# EAGLE design 主机 v0.1 (EAGLE 6.3)
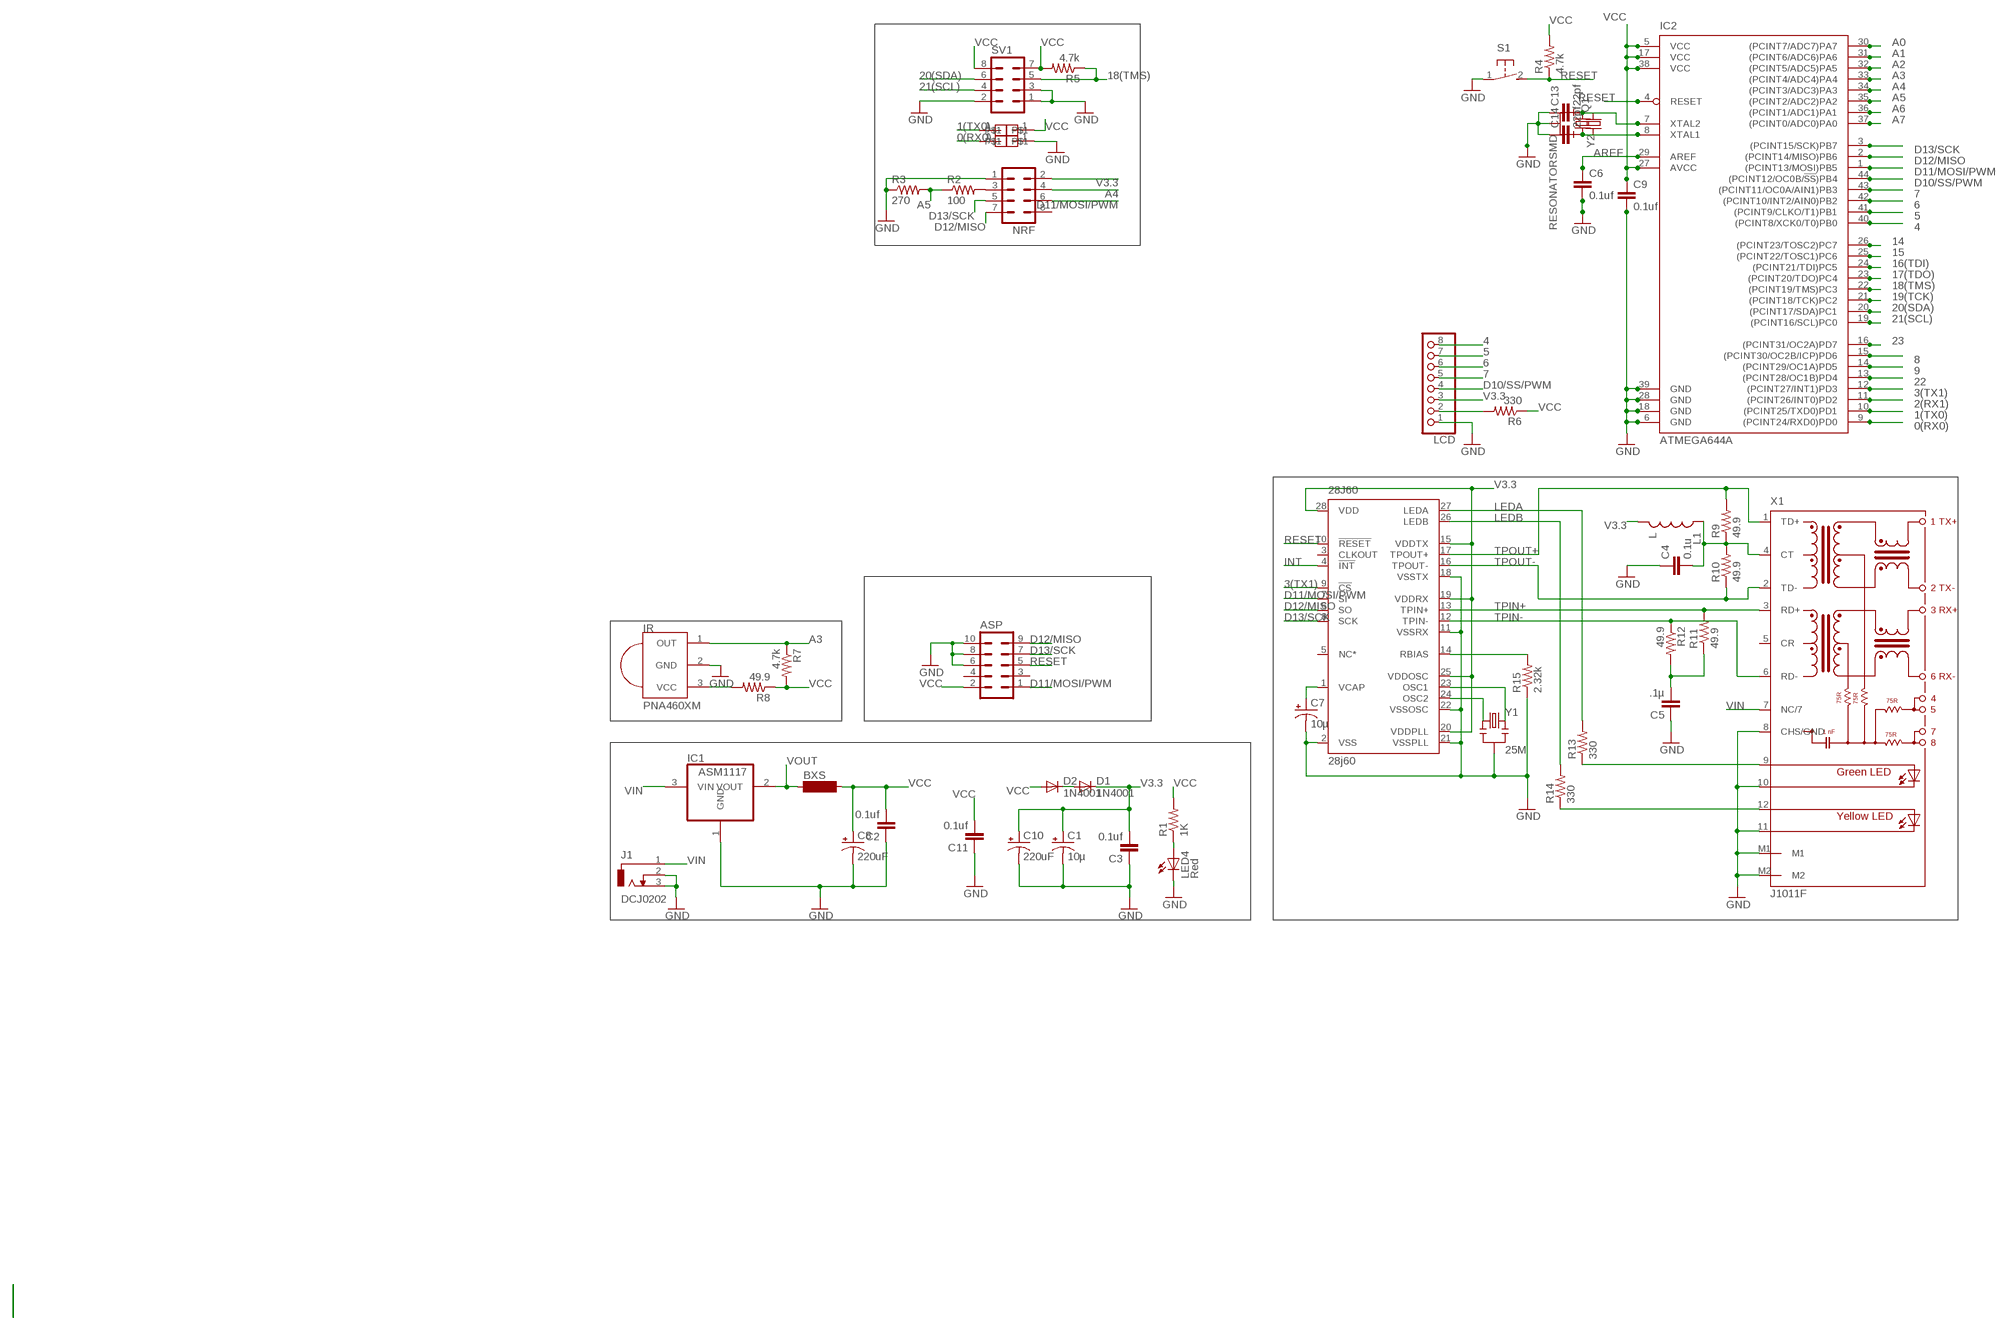
[diagram p0: schematic, sheet 1]

## Parts
28J60  28j60  ENC28J60SOIC  [SO28W]
ASP  MA05-2  [MA05-2]
BXS  SM-1206  [SM-1206]
C1  10µ  CAP_POL3528  [EIA3528]
C2  0.1uf  CAP0603-CAP  [0603-CAP]
C3  0.1uf  CAP0603-CAP  [0603-CAP]
C4  0.1u  CAP0603-CAP  [0603-CAP]
C5  .1µ  CAP0603-CAP  [0603-CAP]
C6  0.1uf  CAP0603-CAP  [0603-CAP]
C7  10µ  CAP_POL3528  [EIA3528]
C8  220uF  CPOL-US153CLV-0605  [153CLV-0605]
C9  0.1uf  CAP0603-CAP  [0603-CAP]
C10  220uF  CPOL-US153CLV-0605  [153CLV-0605]
C11  0.1uf  CAP0603-CAP  [0603-CAP]
C13  22pf  CAP0603-CAP  [0603-CAP]
C14  22pf  CAP0603-CAP  [0603-CAP]
D1  1N4001  DIODESOD  [SOD-323]
D2  1N4001  DIODESOD  [SOD-323]
IC1  ASM1117  REG1117  [SOT223]
IC2  ATMEGA644A  [TQFP44]
IR  PNA460XM  [PNA460XM]
J1  DCJ0202  [DCJ0202]
L1  L  INDUCTOR0603  [0603]
LCD  PINHD-1X8  [1X08]
LED4  Red  LED0805  [0805-LED]
NRF  MA04-2  [MA04-2]
Q1  CRYSTALHC49S  [HC49/S]
R1  1K  RESISTOR0603-RES  [0603-RES]
R2  100  RESISTOR0603-RES  [0603-RES]
R3  270  RESISTOR0603-RES  [0603-RES]
R4  4.7k  RESISTOR0603-RES  [0603-RES]
R5  4.7k  RESISTOR0603-RES  [0603-RES]
R6  330  RESISTOR0603-RES  [0603-RES]
R7  4.7k  RESISTOR0603-RES  [0603-RES]
R8  49.9  RESISTOR0603-RES  [0603-RES]
R9  49.9  RESISTOR0603-RES  [0603-RES]
R10  49.9  RESISTOR0603-RES  [0603-RES]
R11  49.9  RESISTOR0603-RES  [0603-RES]
R12  49.9  RESISTOR0603-RES  [0603-RES]
R13  330  RESISTOR0603-RES  [0603-RES]
R14  330  RESISTOR0603-RES  [0603-RES]
R15  2.32k  RESISTOR0603-RES  [0603-RES]
S1  31-XX  [B3F-31XX]
SV1  MA04-2  [MA04-2]
U$4  PIN1  [PIN1]
U$5  PIN1  [PIN1]
U$6  PIN1  [PIN1]
U$7  PIN1  [PIN1]
X1  J1011F  RJ45-HR911105A  [HRJ]
Y1  25M  RESONATORSMD  [RESONATOR-SMD]
Y2  RESONATORSMD  [RESONATOR-SMD]

## Nets
0(RX0): IC2.9((PCINT24/RXD0)PD0) U$7.1
1(TX0): IC2.10((PCINT25/TXD0)PD1) U$6.1
2(RX1): IC2.11((PCINT26/INT0)PD2)
3(TX1): 28J60.9(!CS) IC2.12((PCINT27/INT1)PD3)
4: IC2.40((PCINT8/XCK0/T0)PB0) LCD.8
5: IC2.41((PCINT9/CLKO/T1)PB1) LCD.7
6: IC2.42((PCINT10/INT2/AIN0)PB2) LCD.6
7: IC2.43((PCINT11/OC0A/AIN1)PB3) LCD.5
8: IC2.15((PCINT30/OC2B/ICP)PD6)
9: IC2.14((PCINT29/OC1A)PD5)
14: IC2.26((PCINT23/TOSC2)PC7)
15: IC2.25((PCINT22/TOSC1)PC6)
16(TDI): IC2.24((PCINT21/TDI)PC5)
17(TDO): IC2.23((PCINT20/TDO)PC4)
18(TMS): IC2.22((PCINT19/TMS)PC3) R5.1 SV1.5
19(TCK): IC2.21((PCINT18/TCK)PC2)
20(SDA): IC2.20((PCINT17/SDA)PC1) SV1.6
21(SCL): IC2.19((PCINT16/SCL)PC0) SV1.4
22: IC2.13((PCINT28/OC1B)PD4)
23: IC2.16((PCINT31/OC2A)PD7)
A0: IC2.30((PCINT7/ADC7)PA7)
A1: IC2.31((PCINT6/ADC6)PA6)
A2: IC2.32((PCINT5/ADC5)PA5)
A3: IC2.33((PCINT4/ADC4)PA4) IR.1(OUT) R7.1
A4: IC2.34((PCINT3/ADC3)PA3) NRF.4
A5: IC2.35((PCINT2/ADC2)PA2) R2.1 R3.2
A6: IC2.36((PCINT1/ADC1)PA1)
A7: IC2.37((PCINT0/ADC0)PA0)
AREF: C6.1 IC2.29(AREF)
D10/SS/PWM: IC2.44((PCINT12/OC0B/!SS!)PB4) LCD.4
D11/MOSI/PWM: 28J60.7(SI) ASP.1 IC2.1((PCINT13/MOSI)PB5) NRF.6
D12/MISO: 28J60.6(SO) ASP.9 IC2.2((PCINT14/MISO)PB6) NRF.7
D13/SCK: 28J60.8(SCK) ASP.7 IC2.3((PCINT15/SCK)PB7) NRF.5
GND [power]: 28J60.2(VSS) 28J60.11(VSSRX) 28J60.18(VSSTX) 28J60.21(VSSPLL) 28J60.22(VSSOSC) ASP.6 ASP.8 ASP.10 C1.C(-) C2.1 C3.1 C4.1 C5.1 C6.2 C7.C(-) C8.- C9.2 C10.- C11.1 C13.1 C14.1 IC1.1(GND) IC2.6(GND) IC2.18(GND) IC2.28(GND) IC2.39(GND) IR.2(GND) J1.2 J1.3 LCD.1 LED4.C NRF.1 R3.1 R15.1 S1.1(P) SV1.1 SV1.2 SV1.3 U$4.1 X1.8(CHS/GND) X1.10(C-R) X1.11(C-L) X1.M1 X1.M2 Y1.2 Y2.2
INT: 28J60.4(!INT)
LEDA: 28J60.27(LEDA) R13.2
LEDB: 28J60.26(LEDB) R14.2
N$1: C13.2 IC2.7(XTAL2) Q1.2 Y2.1
N$3: IR.3(VCC) R8.2
N$5: LED4.A R1.1
N$7: NRF.3 R2.2
N$9: C5.2 R11.1 R12.2
N$11: 28J60.1(VCAP) C7.A(+)
N$13: 28J60.14(RBIAS) R15.2
N$14: C14.2 IC2.8(XTAL1) Q1.1 Y2.3
N$15: C4.2 L1.1 R9.1 R10.2 X1.4(CT)
N$16: 28J60.24(OSC2) Y1.1
N$17: 28J60.23(OSC1) Y1.3
N$20: D1.2(A) D2.1(C)
N$23: R13.1 X1.9(A-R)
N$24: R14.1 X1.12(AL)
N$29: LCD.2 R6.2
RESET: 28J60.10(!RESET) ASP.5 IC2.4(RESET) R4.1 S1.2(S)
TPIN+: 28J60.13(TPIN+) R11.2 X1.3(RD+)
TPIN-: 28J60.12(TPIN-) R12.1 X1.6(RD-)
TPOUT+: 28J60.17(TPOUT+) R9.2 X1.1(TD+)
TPOUT-: 28J60.16(TPOUT-) R10.1 X1.2(TD-)
V3.3: 28J60.15(VDDTX) 28J60.19(VDDRX) 28J60.20(VDDPLL) 28J60.25(VDDOSC) 28J60.28(VDD) C1.A(+) C3.2 C10.+ D1.1(C) L1.2 LCD.3 NRF.2
VCC: ASP.2 BXS.2 C2.2 C8.+ C9.1 C11.2 D2.2(A) IC2.5(VCC) IC2.17(VCC) IC2.27(AVCC) IC2.38(VCC) R1.2 R4.2 R5.2 R6.1 R7.2 R8.1 SV1.7 SV1.8 U$5.1
VIN: IC1.3(VIN) J1.1 X1.7(NC/7)
VOUT: BXS.1 IC1.2(VOUT)
Unconnected: 28J60.3(CLKOUT) 28J60.5(NC*) ASP.3 ASP.4 NRF.8 X1.5(CR)

## Library data of the parts
28J60 = 00my:ENC28J60: Stand-Alone Ethernet Controller with SPI Interface Source: http://ww1.microchip.com/downloads/en/DeviceDoc/39662c.pdf
ASP = pkj:MA05-2: PIN HEADER; OC_FARNELL: unknown; OC_NEWARK: unknown
BXS = inductor-neosid:SM-1206: INDUCTOR SMD chip inductor; OC_FARNELL: unknown; OC_NEWARK: unknown
C1 C7 = 00my:CAP_POL: Capacitor Polarized These are standard SMD and PTH capacitors. Normally 10uF, 47uF, and 100uF in electrolytic and tantalum varieties. Always verify the external diameter of the through hole cap, it varies with capacity, voltage, and manufacturer. The EIA devices should be standard.
C2 C3 C11 = MY:CAP: Capacitor Standard 0603 ceramic capacitor, and 0.1" leaded capacitor.
C4-C6 C9 C13 C14 = 00my:CAP: Capacitor Standard 0603 ceramic capacitor, and 0.1" leaded capacitor.
C8 C10 = resistor:CPOL-US: POLARIZED CAPACITOR, American symbol
D1 D2 = MY:DIODE: Diode These are standard reverse protection diodes and small signal diodes. SMA package can handle up to about 1A. SOD-323 can handle about 200mA. What the SOD-323 package when ordering, there are some mfgs out there that are 5-pin packages.
IC1 = burr-brown:REG1117: 800mA and 1A Low Dropout (LDO) Positive Regulator 1.8V, 2.5V, 2.85V, 3.3V, 5V, and Adj; MPN: REG1117; OC_FARNELL: 1097566; OC_NEWARK: 14P6981
IC2 = 00my:ATMEGA644: 8-bit Microcontroller with 64K Bytes In-System Programmable Flash Source: http://www.atmel.com/dyn/resources/prod_documents/doc2593.pdf; MPN: ATMEGA644PV-10AU; OC_FARNELL: 1455123; OC_NEWARK: 58M3748
IR = adafruit:PNA460XM: IR 38KHz receiver PNA4602 and related receivers http://www.ladyada.net/library/pcb/eaglelibrary.html
J1 = con-jack:DCJ0202: DC POWER JACK Source: DCJ0202.pdf; OC_FARNELL: unknown; OC_NEWARK: unknown
L1 = 00my:INDUCTOR: Inductors Basic Inductor/Choke - 0603 and 1206. Footprints are not proven and vary greatly between part numbers.
LCD = pinhead:PINHD-1X8: PIN HEADER
LED4 = MY:LED: LEDs Standard schematic elements and footprints for 5mm, 3mm, 1206, and 0603 sized LEDs. 5mm - Spark Fun Electronics SKU : COM-00529 (and others)
NRF SV1 = pkj:MA04-2: PIN HEADER; OC_FARNELL: unknown; OC_NEWARK: unknown
Q1 = crystal:CRYSTAL: CRYSTAL; OC_FARNELL: 1667008; OC_NEWARK: unknown
R1-R3 R5-R8 = MY:RESISTOR: Resistor Basic schematic elements and footprints for 0603, 1206, and PTH 1/10th watt (small) resistors.
R4 R9-R15 = 00my:RESISTOR: Resistor Basic schematic elements and footprints for 0603, 1206, and PTH 1/10th watt (small) resistors.
S1 = switch-omron:31-XX: OMRON SWITCH; MPN: B3F-3100; OC_FARNELL: 959704; OC_NEWARK: 36M3582
U$4-U$7 = pkj:PIN1
X1 = 00my:RJ45: PULSEJACK (TM) 1x1 Tab-UP RJ45 10/100 Base-TX RJ45 1x1 Tab-UP with LEDs 8-pin (J1 series) and 6-pin (JP series) integrated magnetics connector, designed to support applications, such as ADSL modems, LAN-on-Motherboard, and Hub and Switches. Source: www.pulseeng.com .. PulseJack-J402.pdf
Y1 = 00my:RESONATOR: Resonator Small SMD resonator. This is the itty bitty 10/20MHz resonators with built in caps. CSTCE10M0G55 and CSTCE20M0V53. Footprint has been reviewed closely but hasn't been tested yet.
Y2 = MY:RESONATOR: Resonator Small SMD resonator. This is the itty bitty 10/20MHz resonators with built in caps. CSTCE10M0G55 and CSTCE20M0V53. Footprint has been reviewed closely but hasn't been tested yet.

## Net classes
1 power: width 0.381 mm

## Board
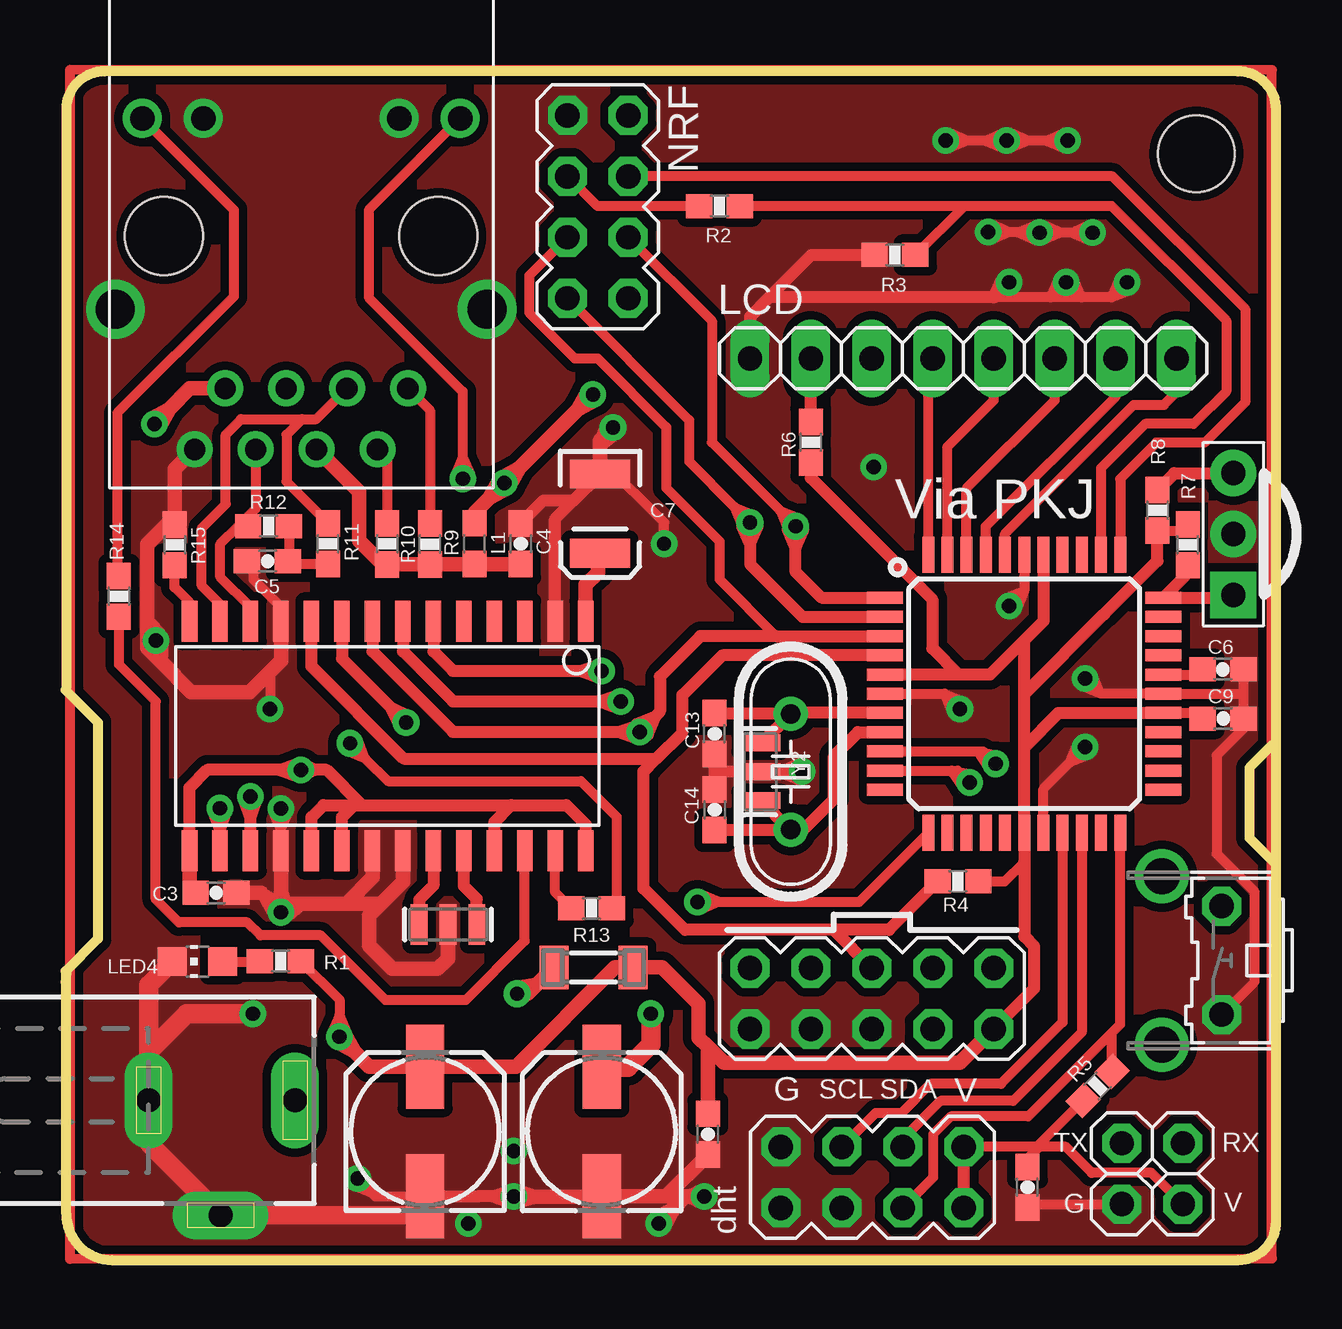
[diagram p1: board, top side]
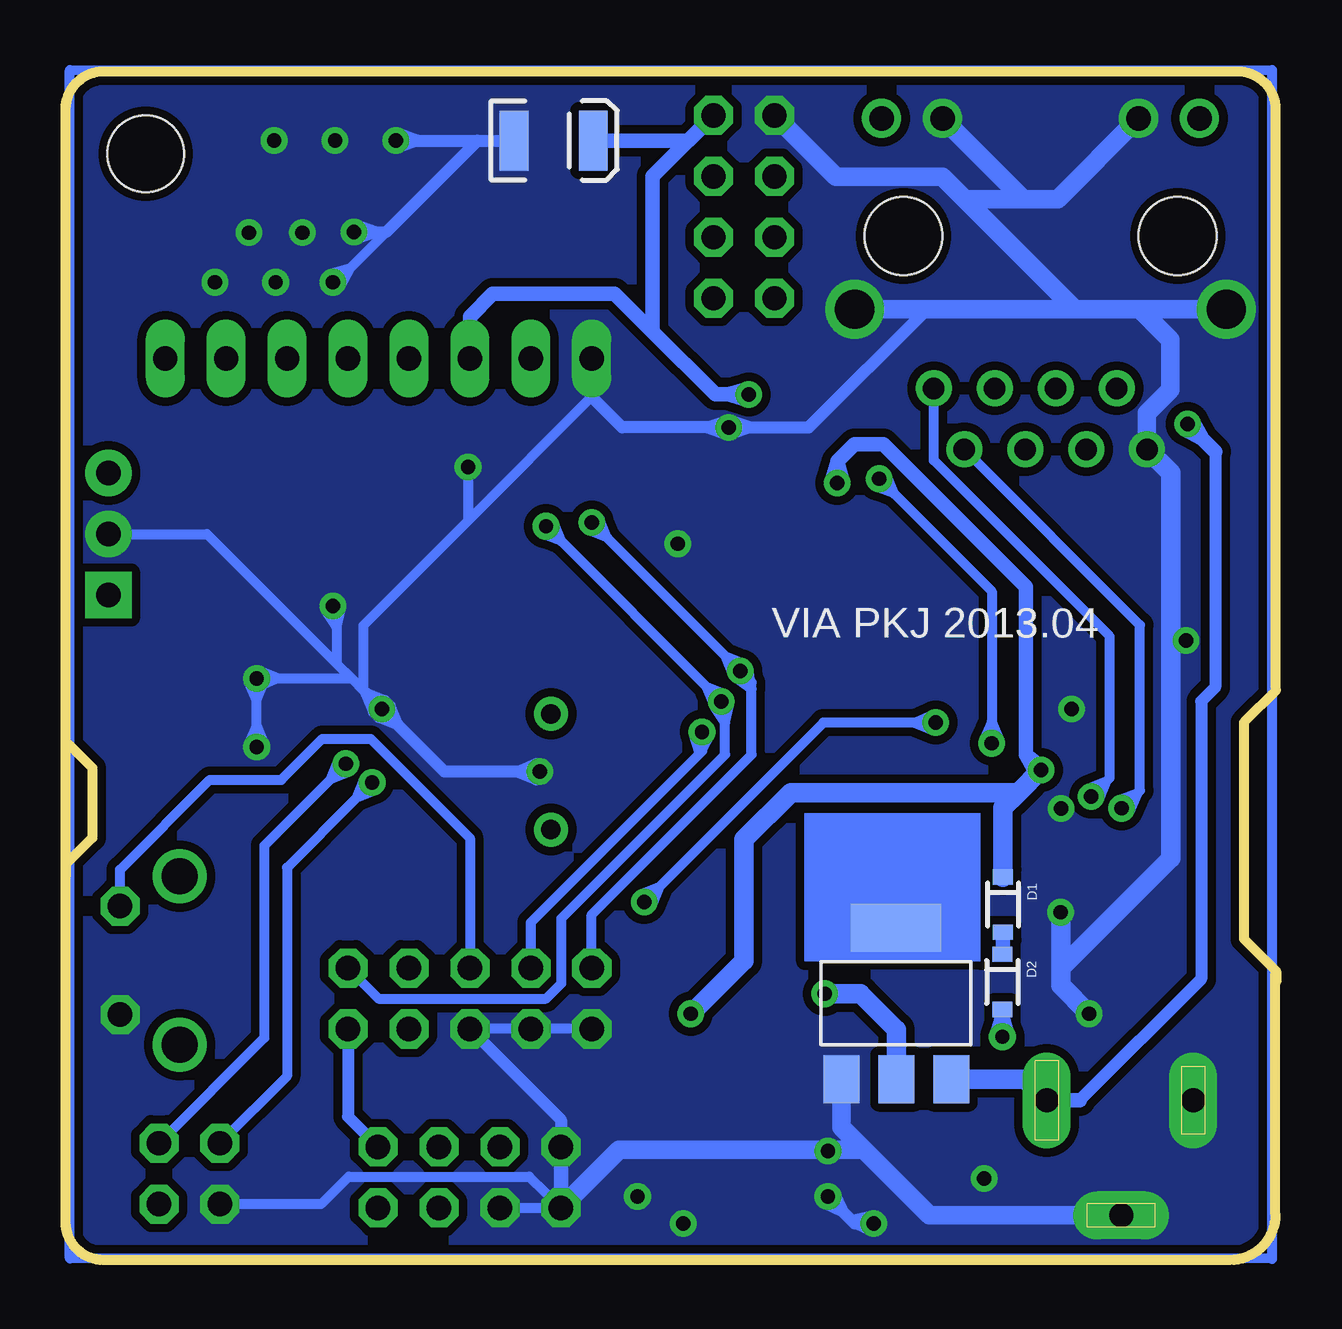
[diagram p2: board, bottom side, seen from below]

Size 50.46 x 49.53 mm. Coordinates in mm from the lower left corner, seen from the top.
Outline: 0.03,47.94 arc-90 1.61,49.53 48.87,49.53 arc-90 50.46,47.94 50.46,1.59 arc-90 48.87,0 1.93,0 arc-90 0.03,1.9 0.03,11.93
Outline: 0.03,47.83 0.03,23.88
Outline: 0,23.75 1.35,22.4 1.35,13.39 0,12.04 0,11.58
Outline: 50.32,21.49 49.34,20.51 49.34,17.59 50.44,16.48 50.44,16.03
Copper layers (1*16): Top 0.035mm / dielectric 1.5mm / Bottom 0.035mm
Design rules "SparkFun *": minimum track width 8mil, minimum drill 20mil, track to track 8mil, track to pad 8mil, pad to pad 8mil, via to via 8mil, smd to smd 8mil, copper to edge 10mil, drill to drill 8mil, minimum pad ring 12mil, minimum via ring 10mil, stop-mask expansion 4mil, vias tented up to drill 20mil, thermal gap 10mil
Holes 3.2 mm at 47.12,46.09

### Footprints (pad centres in the part's own frame; a part is rotated, then mirrored left to right if it is on the bottom)
SO28W = smd 0.65 x 1.7: 1 -7.62,-4.78; 2 -6.35,-4.78; 3 -5.08,-4.78; 4 -3.81,-4.78; 5 -2.54,-4.78; 6 -1.27,-4.78; 7 0,-4.78; 8 1.27,-4.78; 9 2.54,-4.78; 10 3.81,-4.78; 11 5.08,-4.78; 12 6.35,-4.78; 13 7.62,-4.78; 14 8.89,-4.78; 15 8.89,4.78; 16 7.62,4.78; 17 6.35,4.78; 18 5.08,4.78; 19 3.81,4.78; 20 2.54,4.78; 21 1.27,4.78; 22 0,4.78; 23 -1.27,4.78; 24 -2.54,4.78; 25 -3.81,4.78; 26 -5.08,4.78; 27 -6.35,4.78; 28 -7.62,4.78
MA05-2 = drill 1.016 octagon: 1 -5.08,-1.27; 2 -5.08,1.27; 3 -2.54,-1.27; 4 -2.54,1.27; 5 0,-1.27; 6 0,1.27; 7 2.54,-1.27; 8 2.54,1.27; 9 5.08,-1.27; 10 5.08,1.27
SM-1206 = smd 1.2 x 1.8: 1 -1.65,0; 2 1.65,0
EIA3528 = smd 1.2 x 2.5: A 1.65,0; C -1.65,0
0603-CAP = smd 1.1 x 1: 1 -0.85,0; 2 0.85,0
153CLV-0605 = smd 3.5 x 1.6: + 2.7,0; - -2.7,0
SOD-323 = smd 0.63 x 0.83: 1 -1.15,0; 2 1.15,0
SOT223 = smd 1.499 x 2.007: 1 -2.261,-3.15; 2 0.025,-3.15; 3 2.311,-3.15 | smd 3.81 x 2.007: 4 0,3.15
TQFP44 = smd 1.5 x 0.5: 1 -5.8,4; 2 -5.8,3.2; 3 -5.8,2.4; 4 -5.8,1.6; 5 -5.8,0.8; 6 -5.8,0; 7 -5.8,-0.8; 8 -5.8,-1.6; 9 -5.8,-2.4; 10 -5.8,-3.2; 11 -5.8,-4; 23 5.8,-4; 24 5.8,-3.2; 25 5.8,-2.4; 26 5.8,-1.6; 27 5.8,-0.8; 28 5.8,0; 29 5.8,0.8; 30 5.8,1.6; 31 5.8,2.4; 32 5.8,3.2; 33 5.8,4 | smd 0.5 x 1.5: 12 -4,-5.8; 13 -3.2,-5.8; 14 -2.4,-5.8; 15 -1.6,-5.8; 16 -0.8,-5.8; 17 0,-5.8; 18 0.8,-5.8; 19 1.6,-5.8; 20 2.4,-5.8; 21 3.2,-5.8; 22 4,-5.8; 34 4,5.8; 35 3.2,5.8; 36 2.4,5.8; 37 1.6,5.8; 38 0.8,5.8; 39 0,5.8; 40 -0.8,5.8; 41 -1.6,5.8; 42 -2.4,5.8; 43 -3.2,5.8; 44 -4,5.8
PNA460XM = drill 1.016 pad 1.93 square: 1 -2.54,0 | drill 1.016 pad 1.93: 2 0,0; 3 2.54,0
DCJ0202 = drill 1 pad 2 long: 1 0,3.1; 2 4.8,0; 3 0,-3
0603 = smd 1.1 x 1: 1 -0.85,0; 2 0.85,0
1X08 = drill 1.016 long: 1 -8.89,0; 2 -6.35,0; 3 -3.81,0; 4 -1.27,0; 5 1.27,0; 6 3.81,0; 7 6.35,0; 8 8.89,0
0805-LED = smd 1.2 x 1.2: A 0,-1.05; C 0,1.05
MA04-2 = drill 1.016 octagon: 1 -3.81,-1.27; 2 -3.81,1.27; 3 -1.27,-1.27; 4 -1.27,1.27; 5 1.27,-1.27; 6 1.27,1.27; 7 3.81,-1.27; 8 3.81,1.27
HC49/S = drill 0.813: 1 -2.413,0; 2 2.413,0
0603-RES = smd 1.1 x 1: 1 -0.85,0; 2 0.85,0
B3F-31XX = drill 1.016 octagon: 1 -2.261,-1.245; 2 2.261,-1.245 | drill 1.499 pad 2.159: 3 -3.505,1.245; 4 3.505,1.245
PIN1 = drill 1.016 octagon: 1 0,0
HRJ = drill 0.89: 1 4.45,-6.35; 2 3.18,-8.89; 3 1.91,-6.35; 4 0.64,-8.89; 5 -0.63,-6.35; 6 -1.9,-8.89; 7 -3.17,-6.35; 8 -4.44,-8.89 | drill 1.02: 9 6.625,4.9; 10 4.085,4.9; 11 -4.085,4.9; 12 -6.625,4.9 | drill 1.63: M1 -7.745,-3.05; M2 7.745,-3.05 | hole 3.25: -5.715,0; 5.715,0
RESONATOR-SMD = smd 0.7 x 1.7: 1 -1.2,0; 2 0,0; 3 1.2,0

### Placement (x,y rotation side)
28J60  14.06,21.83 180 top
ASP  33.6,10.9 180 top
BXS  22,12.19 0 top
C1  30.11,46.65 0 bottom
C2  26.77,5.24 90 top
C3  6.27,15.3 180 top
C4  18.97,29.84 270 top
C5  8.41,29.12 0 top
C6  48.24,24.61 0 top
C7  22.27,31.1 270 top
C8  14.98,5.36 90 top
C9  48.24,22.56 0 top
C10  22.35,5.35 90 top
C11  40.09,3.03 90 top
C13  27.05,21.94 90 top
C14  27.05,18.76 270 top
D1  11.38,14.81 270 bottom
D2  11.41,11.59 270 bottom
IC1  15.85,10.69 0 bottom
IC2  39.95,23.6 0 top
IR  48.67,30.25 90 top
J1  6.46,6.66 270 top
L1  17.05,29.85 90 top
LCD  37.41,37.57 0 top
LED4  5.5,12.44 90 top
NRF  22.18,43.88 270 top
Q1  30.22,20.35 90 top
R1  8.95,12.45 0 top
R2  27.25,43.92 180 top
R3  34.56,41.88 0 top
R4  37.2,15.78 0 top
R5  43.01,7.25 225 top
R6  31.06,34.07 90 top
R7  46.77,29.8 90 top
R8  45.51,31.24 90 top
R9  15.19,29.83 90 top
R10  13.4,29.84 270 top
R11  10.94,29.85 90 top
R12  8.46,30.58 0 top
R13  21.92,14.66 180 top
R14  2.22,27.65 270 top
R15  4.54,29.8 270 top
S1  46.94,12.48 90 top
SV1  33.62,3.45 0 top
U$4  44.02,2.33 0 top
U$5  46.56,2.33 0 top
U$6  44.02,4.87 0 top
U$7  46.56,4.87 0 top
X1  9.82,42.67 0 top
Y1  15.94,13.98 180 top
Y2  28.95,20.35 270 top

### Tracks (layer width: path | path; a pad name or v marks a point on that pad's centre or on a via)
0(RX0)  (via drill 0.6)
  Top 0.406: IC2.9 38.03,21.2 | 38.03,21.2 38.25,21.2 v38.77,20.68 | 38.03,21.2 38.47,20.49 v38.77,20.68 | 38.03,21.2 38.84,21.02 v38.77,20.68
  Bottom 0.406: 39.41,20.04 42.18,17.27 42.18,9.25 U$7.1 | 39.41,20.04 v38.77,20.68 | 39.41,20.04 39.1,20.81 v38.77,20.68 | 39.41,20.04 38.64,20.35 v38.77,20.68
1(TX0)  (via drill 0.6)
  Top 0.406: IC2.10 36.93,20.4 | 36.93,20.4 37.19,20.4 v37.68,19.9 | 36.93,20.4 37.39,19.71 v37.68,19.9 | 36.93,20.4 37.75,20.25 v37.68,19.9
  Bottom 0.406: 38.32,19.26 41.23,16.35 41.23,7.66 U$6.1 | 38.32,19.26 v37.68,19.9 | 38.32,19.26 38.01,20.03 v37.68,19.9 | 38.32,19.26 37.55,19.58 v37.68,19.9
3(TX1)  (via drill 0.6)
  Top 0.406: v26.34,14.92 27.24,14.92 | 27.24,14.92 33.08,14.92 IC2.12 | 27.24,14.92 26.47,15.25 v26.34,14.92 | 27.24,14.92 26.47,14.6 v26.34,14.92
  Top 0.508: 28J60.9 11.52,25.06 13.55,23.03 | 13.55,23.03 v14.19,22.39 | 13.55,23.03 13.92,22.26 v14.19,22.39 | 13.55,23.03 14.32,22.66 v14.19,22.39
  Bottom 0.406: v14.19,22.39 15.09,22.39 | 15.09,22.39 18.87,22.39 25.7,15.56 | 25.7,15.56 v26.34,14.92 | 15.09,22.39 14.33,22.71 v14.19,22.39 | 15.09,22.39 14.33,22.07 v14.19,22.39 | 25.7,15.56 26.01,14.79 v26.34,14.92 | 25.7,15.56 26.47,15.25 v26.34,14.92
4
  Top 0.406: IC2.40 39.15,30.26 44.52,35.63 45.78,35.63 46.3,36.15 LCD.8
5
  Top 0.406: IC2.41 38.35,30.57 43.76,35.98 LCD.7
6
  Top 0.406: IC2.42 37.55,32.15 41.22,35.82 LCD.6
7
  Top 0.406: IC2.43 36.75,33.89 38.68,35.82 LCD.5
18(TMS)
  Top 0.406: IC2.22 43.95,9.82 43.62,9.48 | 43.62,9.48 40.12,5.98 36.91,5.98 36.16,5.23 36.16,3.44 SV1.5 | R5.1 43.62,9.48
20(SDA)
  Top 0.406: IC2.20 42.35,9.49 39.5,6.63 36.46,6.63 34.89,5.06 SV1.6
21(SCL)
  Top 0.406: IC2.19 41.55,9.91 38.99,7.34 36.06,7.34 34.84,6.12 33.76,6.12 SV1.4
A3
  Top 0.406: 48.41,27.6 IR.1
  Top 0.508: 48.41,27.6 IC2.33 46.62,28.46 R7.1
A4
  Top 0.406: NRF.4 43.64,45.15 49.16,39.63 49.16,35.74 47.48,34.06 45.46,34.06 43.95,32.55 IC2.34
A5
  Top 0.406: 37.45,43.92 43.61,43.92 48.37,39.15 48.37,36.19 47.02,34.84 44.99,34.84 43.15,33 IC2.35 | 37.45,43.92 R2.1 | R3.2 37.45,43.92
AREF
  Top 0.406: IC2.29 47.18,24.4 C6.1
D10/SS/PWM
  Top 0.406: IC2.44 35.95,37.38 LCD.4
D11/MOSI/PWM  (via drill 0.6)
  Top 0.406: NRF.6 26.94,39.13 26.94,34.07 29.79,31.21 | 29.79,31.21 v30.43,30.58 | 30.43,29.68 v30.43,30.58 | 29.79,31.21 30.1,30.44 v30.43,30.58 | 29.79,31.21 30.56,30.9 v30.43,30.58 | v30.43,30.58 30.75,30.44 | v30.43,30.58 30.11,30.44
  Top 0.508: IC2.1 31.51,27.6 30.43,28.68 30.43,29.68 | 28J60.7 14.06,25.36 16.14,23.28 22.23,23.28 | 22.23,23.28 v23.13,23.28 | 30.43,29.68 30.75,30.44 | 30.43,29.68 30.11,30.44 | 22.23,23.28 23.03,23 v23.13,23.28 | 22.23,23.28 23.03,23.56 v23.13,23.28
  Bottom 0.406: v23.13,23.28 23.77,23.92 | 23.77,23.92 29.79,29.94 | 29.79,29.94 v30.43,30.58 | ASP.1 37.41,10.9 30.43,10.9 29.79,11.53 29.79,14.23 22.97,21.06 22.97,22.39 | 22.97,22.39 22.97,22.8 v23.13,23.28 | 29.79,29.94 30.56,30.25 v30.43,30.58 | 29.79,29.94 30.1,30.71 v30.43,30.58 | 23.77,23.92 23,23.6 v23.13,23.28 | 23.77,23.92 23.46,23.15 v23.13,23.28 | 22.97,22.39 23.43,23.08 v23.13,23.28 | 22.97,22.39 22.79,23.21 v23.13,23.28
D12/MISO  (via drill 0.6)
  Top 0.406: NRF.7 25.98,35 25.98,33.28 27.89,31.37 | 27.89,31.37 v28.52,30.74 | v28.52,30.74 28.52,29.84 | 27.89,31.37 28.2,30.61 v28.52,30.74 | 27.89,31.37 28.66,31.06 v28.52,30.74 | v28.52,30.74 28.85,30.6 | v28.52,30.74 28.2,30.6
  Top 0.508: IC2.2 30.72,26.8 28.52,28.99 28.52,29.84 | 28J60.6 15.33,25.36 16.14,24.55 21.44,24.55 | 21.44,24.55 v22.34,24.55 | 28.52,29.84 28.85,30.6 | 28.52,29.84 28.2,30.6 | 21.44,24.55 22.24,24.27 v22.34,24.55 | 21.44,24.55 22.24,24.83 v22.34,24.55
  Bottom 0.406: v22.34,24.55 22.97,25.19 | 22.97,25.19 27.89,30.1 | 27.89,30.1 v28.52,30.74 | ASP.9 28.52,14.39 21.86,21.05 21.86,23.79 | 21.86,23.79 21.86,24.07 v22.34,24.55 | 27.89,30.1 28.66,30.41 v28.52,30.74 | 27.89,30.1 28.2,30.87 v28.52,30.74 | 22.97,25.19 22.2,24.87 v22.34,24.55 | 22.97,25.19 22.66,24.42 v22.34,24.55 | 21.86,23.79 22.54,24.26 v22.34,24.55 | 21.86,23.79 21.99,24.6 v22.34,24.55
D13/SCK  (via drill 0.6)
  Top 0.406: NRF.5 19.32,41.02 19.32,39.47 21.22,37.57 22.17,37.57 25.03,34.71 25.03,32.17 27.25,29.95 27.25,28.36 29.62,26 | 24.57,22.65 v23.93,22.01 | v23.93,22.01 23.8,22.33 | v23.93,22.01 24.26,21.88
  Top 0.508: IC2.3 29.62,26 26.46,26 24.77,24.31 24.77,22.85 24.57,22.65 | 28J60.8 12.79,25.36 16.14,22.01 23.03,22.01 | 23.03,22.01 v23.93,22.01 | 23.03,22.01 23.83,21.73 v23.93,22.01 | 23.03,22.01 23.83,22.29 v23.93,22.01 | 24.57,22.65 23.8,22.33 | 24.57,22.65 24.26,21.88
  Bottom 0.406: ASP.7 31.06,14.07 24.02,21.11 | 24.02,21.11 23.92,21.22 23.92,21.53 v23.93,22.01 | 24.02,21.11 24.27,21.91 v23.93,22.01 | 24.02,21.11 23.62,21.84 v23.93,22.01
GND  (via drill 0.6)
  Top 0.406: 28J60.11 8.98,27.21 7.83,28.35 7.83,28.85 C5.1 | 8.98,15.61 28J60.18 8.97,17.92 | R15.1 4.23,30.65 | 14.18,1.86 C8.- | C3.1 7.33,15.31 | v12.17,3.39 12.81,2.76 | 12.81,2.76 12.91,2.66 17.17,2.66 | v8.97,18.82 8.97,17.92 | v41.7,40.74 41.07,40.11 | 41.07,40.11 41.06,40.11 | 41.06,40.11 38.68,40.11 | C6.2 49.09,23.6 | 49.09,23.6 C9.2 | C9.2 | 49.09,23.6 IC2.28 43.13,23.6 | IC2.39 39.95,27.89 | 39.95,27.89 39.95,27.88 v39.32,27.25 | IC2.6 36.64,23.6 | 36.64,23.6 v37.27,22.96 | 43.13,23.6 v42.49,24.23 | IC2.18 40.75,19.63 41.86,20.74 | 41.86,20.74 v42.49,21.37 | 29.8,20.35 v30.7,20.35 | S1.1 49.56,11.6 49.56,15.34 47.98,16.93 47.98,21.03 49.09,22.14 C9.2 | v44.24,40.74 43.61,40.11 43.6,40.11 | 43.6,40.11 42.34,40.11 | 42.34,40.11 41.07,40.11 | v42.81,42.81 41.91,42.81 | 41.91,42.81 41.49,42.81 | 41.49,42.81 v40.59,42.81 | v40.59,42.81 40.56,42.83 39.69,42.83 | 39.69,42.83 39.34,42.83 | 39.34,42.83 v38.44,42.83 | v41.76,46.65 40.86,46.65 | 40.86,46.65 40.12,46.65 | 40.12,46.65 v39.22,46.65 | v39.22,46.65 38.32,46.65 | 38.32,46.65 37.58,46.65 | 37.58,46.65 v36.68,46.65 | 12.81,2.76 12.5,3.53 v12.17,3.39 | 12.81,2.76 12.04,3.07 v12.17,3.39 | 37.58,46.65 36.82,46.97 v36.68,46.65 | 37.58,46.65 36.82,46.32 v36.68,46.65 | 8.97,17.92 9.29,18.68 v8.97,18.82 | 8.97,17.92 8.64,18.68 v8.97,18.82 | 39.34,42.83 38.58,43.15 v38.44,42.83 | 39.34,42.83 38.58,42.51 v38.44,42.83 | 41.06,40.11 41.83,40.42 v41.7,40.74 | 41.06,40.11 41.38,40.87 v41.7,40.74 | 42.34,40.11 42.03,40.87 v41.7,40.74 | 42.34,40.11 41.57,40.42 v41.7,40.74 | 43.6,40.11 44.37,40.42 v44.24,40.74 | 43.6,40.11 43.92,40.87 v44.24,40.74 | 41.91,42.81 42.68,42.48 v42.81,42.81 | 41.91,42.81 42.68,43.13 v42.81,42.81
  Top 0.406: 41.49,42.81 40.73,43.13 v40.59,42.81 | 41.49,42.81 40.73,42.48 v40.59,42.81 | 39.69,42.83 40.44,42.49 v40.59,42.81 | 39.69,42.83 40.46,43.13 v40.59,42.81 | 40.12,46.65 39.36,46.97 v39.22,46.65 | 40.12,46.65 39.36,46.32 v39.22,46.65 | 38.32,46.65 39.09,46.32 v39.22,46.65 | 38.32,46.65 39.09,46.97 v39.22,46.65 | 40.86,46.65 41.63,46.32 v41.76,46.65 | 40.86,46.65 41.63,46.97 v41.76,46.65 | 43.13,23.6 42.82,24.36 v42.49,24.23 | 43.13,23.6 42.36,23.91 v42.49,24.23 | 36.64,23.6 36.95,22.83 v37.27,22.96 | 36.64,23.6 37.41,23.29 v37.27,22.96 | 39.95,27.89 39.19,27.57 v39.32,27.25 | 39.95,27.89 39.64,27.12 v39.32,27.25 | v30.7,20.35 30.56,20.03 | v30.7,20.35 30.56,20.67 | 41.86,20.74 42.63,21.05 v42.49,21.37 | 41.86,20.74 42.17,21.51 v42.49,21.37 | v24.94,29.84 24.94,30.73 22.43,33.25 22.27,33.25 | C11.1 40.24,2.33 U$4.1 | v8.52,22.96 8.54,22.98 8.54,24.53
  Top 0.508: 28J60.2 20.41,30.89 21.17,31.65 | 21.17,31.65 C7.C | C4.1 19.93,31.65 21.17,31.65 | C8.- 17.17,2.66 17.78,2.66 | v18.68,2.64 18.67,2.66 17.78,2.66 | v39.32,40.74 38.68,40.11 | 38.68,40.11 29.32,40.11 | 29.32,40.11 28.52,39.31 LCD.1 | C13.1 27.05,20.35 | 27.05,20.35 C14.1 | 27.05,20.35 Y2.2 29.8,20.35 | 17.78,2.66 18.58,2.36 v18.68,2.64 | 17.78,2.66 18.59,2.93 v18.68,2.64 | 38.68,40.11 39.45,40.47 v39.32,40.74 | 38.68,40.11 39.05,40.87 v39.32,40.74 | 29.8,20.35 30.56,20.03 | 29.8,20.35 30.56,20.67 | 29.32,40.11 31.09,41.88 R3.1
  Top 0.61: 11.7,14.85 13.15,14.85 | 13.15,14.85 14.06,15.76 28J60.22 | 28J60.21 12.79,15.94 11.7,14.85 | Y1.2 15.94,12.56 15.51,12.13 13.61,12.13 12.66,13.09 12.66,14.36 13.15,14.85 | 28J60.11 8.98,24.97 8.54,24.53 7.68,23.66 5.24,23.66 3.96,24.94 | 28J60.18 8.98,15.39 | 8.98,15.39 v8.98,14.49 | v22.82,34.69 22.27,34.15 22.27,33.98 | 22.27,33.98 22.27,33.25 C7.C | R15.1 4.54,32.94 X1.8 | 4.23,30.65 3.41,29.83 3.41,26.65 | 3.41,26.65 3.41,25.5 3.96,24.94 | 11.7,14.85 9.8,14.85 | 9.8,14.85 9.34,14.85 v8.98,14.49 | 7.33,15.31 8.16,15.31 8.34,15.13 | 8.34,15.13 v8.98,14.49 | 19.58,2.64 21.71,2.64 C10.- 25.03,2.65 | 19.58,2.64 v18.68,2.64 | C2.1 25.03,2.65 | v26.62,2.64 26.29,2.65 26.04,2.65 | 26.04,2.65 25.03,2.65 | v24.71,1.53 25.35,2.17 | 25.35,2.17 25.83,2.64 26.04,2.64 | 26.04,2.64 v26.62,2.64 | 8.98,15.39 8.74,14.56 v8.98,14.49 | 8.98,15.39 9.22,14.56 v8.98,14.49 | 9.8,14.85 8.94,14.74 v8.98,14.49 | 9.8,14.85 9.14,14.3 v8.98,14.49 | 8.34,15.13 8.76,14.37 v8.98,14.49 | 8.34,15.13 9.1,14.71 v8.98,14.49 | 22.27,33.98 22.97,34.5 v22.82,34.69 | 22.27,33.98 22.58,34.78 v22.82,34.69 | 19.58,2.64 18.75,2.88 v18.68,2.64 | 19.58,2.64 18.75,2.4 v18.68,2.64 | 3.41,26.65 3.51,25.79 v3.76,25.82 | 3.41,26.65 3.95,25.98 v3.76,25.82 | 3.96,24.94 4.01,25.81 v3.76,25.82 | 3.96,24.94 3.54,25.7 v3.76,25.82 | 26.04,2.65 26.55,2.4 v26.62,2.64 | 26.04,2.65 26.55,2.88 v26.62,2.64 | 26.04,2.64 26.55,2.4 v26.62,2.64 | 26.04,2.64 26.55,2.88 v26.62,2.64 | 25.35,2.17 24.59,1.75 v24.71,1.53 | 25.35,2.17 24.93,1.41 v24.71,1.53
  Top 0.762: 14.18,1.86 J1.2 3.46,4.86 3.46,5.82 J1.3
  Top 0.813: 3.46,8.67 3.46,11.45 LED4.C | 3.46,8.67 3.46,5.82 | v7.8,10.26 5.05,10.26 3.46,8.67
  Bottom 0.406: 37.1,42.83 38.62,41.31 | 38.62,41.31 39.19,40.74 v39.32,40.74 | v39.32,27.25 39.16,27.09 39.16,26.36 | v42.49,21.37 42.49,22.27 | 42.49,22.27 42.49,23.33 | 42.49,23.33 v42.49,24.23 | ASP.10 ASP.8 ASP.6 | 39.16,26.36 39.16,24.85 | 39.16,24.85 38.54,24.23 | 38.54,24.23 38.05,23.74 | 38.05,23.74 37.91,23.6 v37.27,22.96 | IR.2 44.56,30.25 39.16,24.85 | v42.49,24.23 41.59,24.23 | 41.59,24.23 38.54,24.23 | 28.52,35.96 33.68,30.81 | 33.68,30.81 38.05,26.44 38.05,23.74 | 36.64,22.33 v37.27,22.96 | 38.62,41.31 39.01,40.58 v39.32,40.74 | 38.62,41.31 39.42,41.08 v39.32,40.74 | 42.49,23.33 42.82,24.09 v42.49,24.23 | 42.49,23.33 42.17,24.09 v42.49,24.23 | 41.59,24.23 42.36,23.91 v42.49,24.23 | 41.59,24.23 42.36,24.55 v42.49,24.23 | v37.27,22.96 37.14,23.29 | v37.27,22.96 37.6,22.83 | v37.27,22.96 37.41,22.64 | v37.27,22.96 36.95,23.09 | 39.16,26.36 39.61,27.06 v39.32,27.25 | 39.16,26.36 38.98,27.17 v39.32,27.25 | 30.83,20.67 v30.7,20.35 30.83,20.03 | 42.49,22.27 42.17,21.51 v42.49,21.37 | 42.49,22.27 42.82,21.51 v42.49,21.37 | v33.68,33.05 33.68,30.81 | U$4.1 39.81,2.33 38.66,3.48 31.13,3.48 SV1.1 SV1.3
  Bottom 0.508: v22.82,34.69 21.92,34.69 | 21.92,34.69 19.48,34.69 14.56,39.62 | 33.29,46.65 C1.C | v36.68,46.65 35.78,46.65 | 35.78,46.65 33.29,46.65 | 33.29,46.65 37.1,42.83 37.54,42.83 | v38.44,42.83 37.54,42.83 | v22.82,34.69 23.72,34.69 | 23.72,34.69 27.25,34.69 28.52,35.96 | v16.78,1.53 17.57,1.53 17.67,1.63 | 17.67,1.63 18.05,2.01 | 18.05,2.01 v18.68,2.64 | v30.7,20.35 31.6,20.35 | 31.6,20.35 34.66,20.35 36.64,22.33 | 21.92,34.69 22.72,34.41 v22.82,34.69 | 21.92,34.69 22.72,34.98 v22.82,34.69 | 23.72,34.69 22.92,34.98 v22.82,34.69 | 23.72,34.69 22.92,34.41 v22.82,34.69 | 18.05,2.01 18.81,2.37 v18.68,2.64 | 18.05,2.01 18.41,2.77 v18.68,2.64 | 35.78,46.65 36.58,46.36 v36.68,46.65 | 35.78,46.65 36.58,46.93 v36.68,46.65 | 37.54,42.83 38.34,42.55 v38.44,42.83 | 37.54,42.83 38.34,43.11 v38.44,42.83 | 17.67,1.63 16.84,1.82 v16.78,1.53 | 17.67,1.63 16.91,1.26 v16.78,1.53 | 37.14,23.29 37.91,23.6 37.6,22.83 | 36.64,22.33 37.41,22.64 | 36.64,22.33 36.95,23.09 | 31.6,20.35 30.83,20.67 | 31.6,20.35 30.83,20.03 | ASP.6 29.81,5.84 SV1.2
  Bottom 0.61: SV1.2 SV1.1 | LCD.1 28.52,35.96
  Bottom 0.762: X1.M1 5.67,39.62 | 5.67,39.62 8.39,39.62 | 8.39,39.62 14.56,39.62 X1.M2 | 12.97,44.2 13.9,45.13 18.35,45.13 NRF.1 | 12.97,44.2 8.39,39.62 | X1.11 9.1,44.2 10.54,44.2 | 10.54,44.2 12.97,44.2 | X1.10 10.54,44.2 | X1.8 5.38,35.29 4.4,36.26 4.4,38.35 5.67,39.62 | J1.2 14.44,1.86 17.18,4.59 | 17.18,4.59 27.39,4.59 SV1.1 | IC1.1 18.11,5.52 17.18,4.59
  Bottom 0.813: v7.8,10.26 8.98,11.44 8.98,12.17 | 8.98,12.17 v8.98,14.49 | X1.8 4.39,32.79 4.39,16.75 8.98,12.17
  other vias: 18.68,4.55
  pour Bottom (isolate 0.356, no thermals): 0.17,49.59 50.28,49.58 50.28,0.06 0.17,0.05
  pour Top (isolate 0.356, no thermals): 0.17,49.59 50.28,49.58 50.28,0.06 0.17,0.05
LEDA
  Top 0.406: R13.2 20.41,15.32 28J60.27
LEDB
  Top 0.406: 28J60.26 19.14,13.29 16.68,10.84 13.32,10.84 10.63,13.52 8.12,13.52 7.57,14.07 4.71,14.07 3.76,15.02 3.76,23.28 2.22,24.82 R14.2
N$1
  Top 0.406: 30.25,22.79 Q1.2 30.26,22.8 | Y2.1 29.01,21.55
  Top 0.508: C13.2 30.25,22.79 | 29.01,21.55 Q1.2 | IC2.7 30.26,22.8
N$3
  Top 0.508: R8.2 46.21,32.79 IR.3
N$5
  Top 0.406: LED4.A 8.09,12.44 R1.1
N$7
  Top 0.406: R2.2 22.17,43.92 20.94,45.15 NRF.3
N$9
  Top 0.406: R11.1 9.38,29 C5.2 9.31,29.16 R12.2
N$10
  Bottom 0.406: 0.17,49.59 0.17,0.05 50.28,0.06 50.28,49.58 0.17,49.59
N$11
  Top 0.406: 22.18,29.36 C7.A
  Top 0.61: 28J60.1 21.68,28.14 22.18,28.64 22.18,29.36
N$13
  Top 0.406: 28J60.14 5.17,27.4 4.54,28.02 R15.2
N$14
  Top 0.406: C14.2 27.07,17.94 | 30.17,17.94 Q1.1
  Top 0.508: 27.07,17.94 Q1.1 30.76,17.94 32.03,19.2 32.03,21.01 33.02,22 IC2.8 | Y2.3 30.17,17.94
N$15
  Top 0.406: R10.2 13.22,28.99
  Top 0.61: R10.2 R9.1 17.03,28.98 L1.1 C4.2 | X1.4 12.23,32.01 12.23,29.97 13.22,28.99
N$16
  Top 0.508: Y1.1 17.14,15.04 16.6,15.58 28J60.24
N$17
  Top 0.508: 28J60.23 15.33,15.61 14.74,15.02 Y1.3
N$20
  Bottom 0.406: 11.38,12.76 D2.1
  Bottom 0.61: D1.2 11.38,12.76
N$22
  Top 0.406: 0.17,49.59 0.17,0.05 50.28,0.06 50.28,49.58 0.17,49.59
N$23  (via drill 0.6)
  Top 0.406: R13.1 22.97,14.85 22.97,18.46 21.48,19.95 13.43,19.95 12.49,20.9 | X1.9 12.66,43.78 12.66,40.07 16.55,36.18 16.55,33.45 | 16.55,33.45 v16.55,32.55 | v11.86,21.53 12.49,20.9 | 16.55,33.45 16.23,32.69 v16.55,32.55 | 16.55,33.45 16.87,32.69 v16.55,32.55 | 12.49,20.9 12.18,21.66 v11.86,21.53 | 12.49,20.9 11.72,21.21 v11.86,21.53
  Bottom 0.406: v16.55,32.55 15.91,31.92 | 15.91,31.92 11.86,27.86 11.86,22.43 | 11.86,22.43 v11.86,21.53 | 15.91,31.92 16.68,32.23 v16.55,32.55 | 15.91,31.92 16.22,32.69 v16.55,32.55 | 11.86,22.43 11.53,21.67 v11.86,21.53 | 11.86,22.43 12.18,21.67 v11.86,21.53
N$24
  Top 0.406: X1.12 7.01,43.75 7.01,40.14 2.16,35.29 2.16,28.57 R14.1
N$29
  Top 0.508: R6.2 LCD.2
RESET
  Top 0.508: 28J60.10 10.25,24.73 14.09,20.89 24.62,20.89 | ASP.5 32.02,13.75 | 32.02,13.75 25.82,13.75 24.08,15.49 24.08,20.35 24.62,20.89 | R4.1 34.32,13.75 32.02,13.75 | IC2.4 27.37,25.2 25.71,23.53 25.71,21.98 24.62,20.89
  Bottom 0.406: S1.2 48.18,16.27 44.45,20.01 41.47,20.01 39.76,21.72 37.74,21.72 33.6,17.58 ASP.5
TPIN+
  Top 0.406: X1.3 10.45,35.03 9.85,35.03 | R11.2 9.21,32.43 9.21,34.39 9.85,35.03 | 28J60.13 6.44,27.33 5.67,28.09 5.67,30.49 6.67,31.49 6.67,34.39 7.31,35.03 9.85,35.03
TPIN-
  Top 0.406: 28J60.12 7.71,27.2 6.45,28.45 6.45,29.83 7.2,30.58 | 7.2,30.58 R12.1 | X1.6 7.92,31.3 7.2,30.58
TPOUT+  (via drill 0.6)
  Top 0.406: X1.1 15.19,35.4 R9.2
  Top 0.508: 28J60.17 7.71,18.42 | 7.71,18.42 v7.71,19.32 | 7.71,18.42 7.99,19.22 v7.71,19.32 | 7.71,18.42 7.43,19.22 v7.71,19.32
  Bottom 0.406: v7.71,19.32 6.94,20.09 6.94,25.99 14.27,33.32 X1.1 | v7.71,19.32 7.38,19.19 7.07,19.96 7.84,19.64 v7.71,19.32
TPOUT-  (via drill 0.6)
  Top 0.406: X1.2 13.4,33.37 R10.1
  Top 0.508: 28J60.16 6.44,17.93 | 6.44,17.93 v6.44,18.83 | 6.44,17.93 6.72,18.73 v6.44,18.83 | 6.44,17.93 6.16,18.73 v6.44,18.83
  Bottom 0.406: v6.44,18.83 5.79,19.45 | 5.79,19.45 5.67,19.56 5.67,26.45 X1.2 | 5.79,19.45 6.12,18.69 v6.44,18.83 | 5.79,19.45 6.56,19.15 v6.44,18.83
V3.3  (via drill 0.6)
  Top 0.406: L1.2 17.05,31.13 | C3.2 5.17,15.76
  Top 0.508: 28J60.15 5.17,19.68 5.91,20.42 8.9,20.42 | 12.02,18.95 10.75,18.95 10.25,18.45 28J60.19 | 12.02,18.95 12.34,18.95 | 12.34,18.95 18.57,18.95 | 18.57,18.95 20.88,18.95 21.68,18.15 28J60.28 | 28J60.25 17.87,18.25 18.57,18.95 | 28J60.20 11.52,18.45 12.02,18.95 | 12.34,18.95 10.87,20.42 10.38,20.42 | 10.38,20.42 v9.8,20.42 | v9.8,20.42 8.9,20.42 | 10.38,20.42 9.9,20.71 v9.8,20.42 | 10.38,20.42 9.9,20.14 v9.8,20.42 | 8.9,20.42 9.7,20.14 v9.8,20.42 | 8.9,20.42 9.7,20.71 v9.8,20.42
  Top 0.61: 17.05,31.13 17.65,31.74 | 17.65,31.74 v18.29,32.37 | v18.29,32.37 18.93,33.01 | 18.93,33.01 21.34,35.43 | 21.34,35.43 v21.98,36.06 | 5.17,15.76 28J60.15 | 22.36,8.04 C10.+ 22.81,8.05 | 21.34,35.43 22.1,35.85 v21.98,36.06 | 21.34,35.43 21.76,36.19 v21.98,36.06 | 17.65,31.74 18.41,32.16 v18.29,32.37 | 17.65,31.74 18.07,32.5 v18.29,32.37 | 18.93,33.01 18.17,32.59 v18.29,32.37 | 18.93,33.01 18.51,32.25 v18.29,32.37
  Top 0.813: 22.81,8.05 22.18,8.68 | v24.4,10.26 24.4,8.99 23.44,8.04 22.36,8.04
  Bottom 0.406: 11.38,16.58 11.39,16.58
  Bottom 0.61: v21.98,36.06 22.88,36.06 | 25.99,38.68 25.99,45.15 NRF.2 24.5,46.65 C1.A | 18.29,33.27 17.57,33.99 16.37,33.99 10.44,28.06 10.44,21.38 10.43,21.06 | 18.29,33.27 v18.29,32.37 | 10.43,21.06 v9.8,20.42 | LCD.3 33.6,39.31 32.65,40.27 27.58,40.27 25.99,38.68 | 22.88,36.06 22.05,36.3 v21.98,36.06 | 22.88,36.06 22.05,35.83 v21.98,36.06 | 18.29,33.27 18.05,32.44 v18.29,32.37 | 18.29,33.27 18.53,32.44 v18.29,32.37 | 10.43,21.06 9.89,20.62 v9.8,20.42 | 10.43,21.06 10.02,20.3 v9.8,20.42 | 22.88,36.06 23.38,36.06 25.99,38.68
  Bottom 0.813: 11.39,16.58 11.39,18.83 10.75,19.47 | 10.75,19.47 v9.8,20.42 | D1.1 11.38,16.58 | v24.4,10.26 22.18,12.48 22.18,17.52 20.23,19.47 10.75,19.47
VCC  (via drill 0.6)
  Top 0.406: 11.41,10.21 11.41,10.85 R1.2 | 11.41,10.21 v11.41,9.31 | IC2.27 47.16,22.8 C9.1 | 43.28,26.9 43.26,26.9 | R8.1 46.36,30.39 R7.2 | R4.2 39.15,15.78 39.95,16.58 | 11.41,10.21 11.09,9.44 v11.41,9.31 | 11.41,10.21 11.73,9.44 v11.41,9.31 | R5.2 40.48,4.71 | 40.48,4.71 SV1.8 | U$5.1 45.26,3.63 42.77,3.63 41.69,4.71 40.59,4.71 | 40.59,4.71 40.48,4.71 | C11.2 40.09,4.22 40.59,4.71
  Top 0.508: C8.+ 17.83,8.06 | 39.95,21.37 IC2.17 39.95,16.58 39.95,13.48 40.37,13.07 40.37,11.31 ASP.2 | IC2.27 41.38,22.8 39.95,21.37 | IC2.38 40.75,26.62 39.95,25.82 | 39.95,25.82 38.53,24.4 37.21,24.4 | 37.21,24.4 IC2.5 | 39.95,21.37 39.95,23.6 | 39.95,23.6 39.95,25.82 | SV1.7 SV1.8 | R6.1 31.06,32.58 36.13,27.52 36.13,25.49 37.21,24.4 | 43.28,26.9 45.51,29.13 R8.1 | 43.26,26.9 39.95,23.6
  Top 0.61: v11.41,9.31 12.05,8.67 | 12.05,8.67 12.66,8.06 C8.+ | ASP.2 37.27,8.21 27.44,8.21 26.77,8.88 | C8.+ 15.02,8.03 | C8.+ 18.77,8.06 22.9,12.19 BXS.2 24.86,12.19 26.38,10.67 26.38,9.27 26.77,8.88 | C2.2 26.77,8.88 | 12.05,8.67 11.63,9.43 v11.41,9.31 | 12.05,8.67 11.29,9.09 v11.41,9.31
  Bottom 0.508: ASP.2 38.69,5.97 SV1.8
  Bottom 0.61: D2.2 11.41,10.21 | 11.41,10.21 v11.41,9.31 | ASP.2 | 11.41,10.21 11.17,9.37 v11.41,9.31 | 11.41,10.21 11.65,9.37 v11.41,9.31
VIN  (via drill 0.6)
  Top 0.61: X1.7 5.18,36.32 4.33,35.47 | 4.33,35.47 v3.7,34.84 | 4.33,35.47 3.58,35.05 v3.7,34.84 | 4.33,35.47 3.91,34.72 v3.7,34.84
  Bottom 0.508: 2.54,33.68 2.54,23.86 3.12,23.28 3.12,11.71 8.18,6.66
  Bottom 0.61: v3.7,34.84 3.06,34.2 | 3.06,34.2 2.54,33.68 | 8.18,6.66 J1.1 | 3.06,34.2 3.82,34.62 v3.7,34.84 | 3.06,34.2 3.48,34.96 v3.7,34.84
  Bottom 0.813: J1.1 10.44,7.54 IC1.3
VOUT  (via drill 0.6)
  Top 0.61: v18.82,11.09 19.26,11.09 19.63,11.47 | 19.63,11.47 BXS.1 | 19.63,11.47 18.78,11.34 v18.82,11.09 | 19.63,11.47 18.98,10.91 v18.82,11.09
  Bottom 0.813: IC1.2 15.82,9.59 17.33,11.09 v18.82,11.09
(copper drawn outside any net)
  shapes: Bottom area x1

### Text on the board
tPlace: Via PKJ | G | SCL | SDA | V | TX | RX | G | V | dht
bPlace: VIA PKJ 2013.04